# Altium project DRV8874 MOTOR DRV.PrjPcb
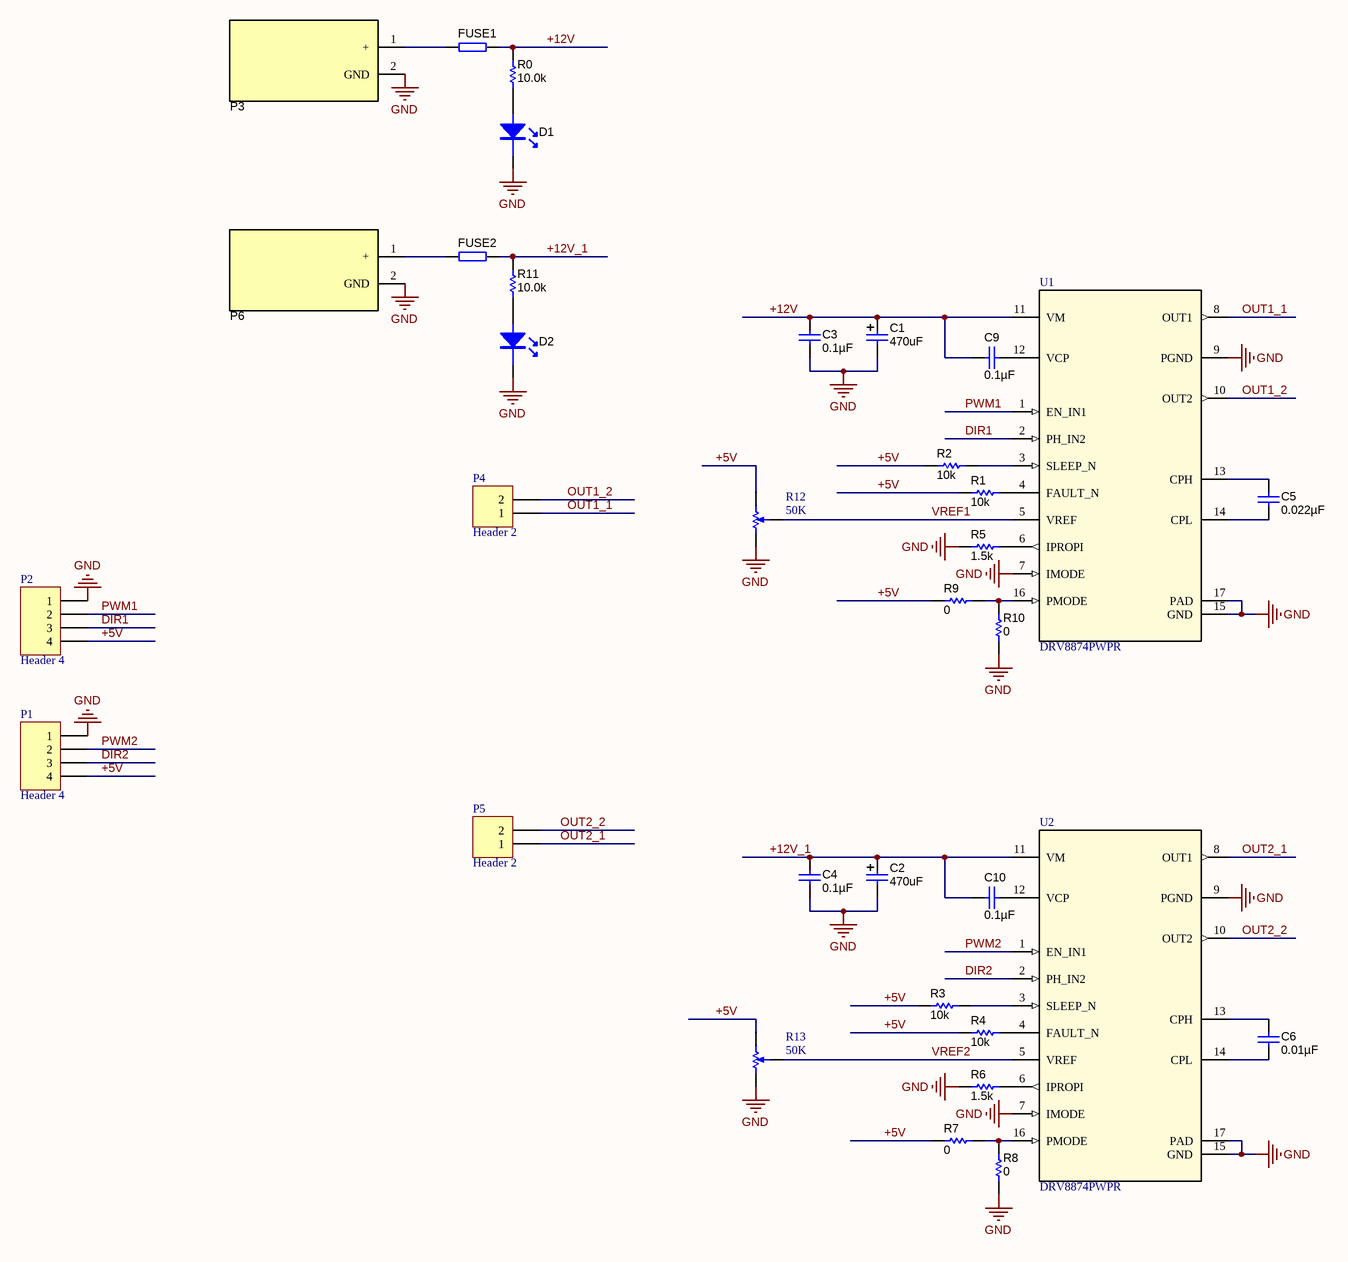
[diagram p0: DRV8874 MOTOR DRV.SchDoc]
1 sheet, 34 parts. Net scope: global (net labels, ports and power ports of the same name join across sheets).
Board file: DRV8874 MOTOR DRV.PcbDoc

## Sheet DRV8874 MOTOR DRV.SchDoc
size A2

### Parts
C1  470uF  [CAP]
C2  470uF  [CAP]
C3  ValueDisplayed: 0.1µF  [0805_HV]  (hidden comment: 08051C103JAT2A)
C4  ValueDisplayed: 0.1µF  [0805_HV]  (hidden comment: 08051C103JAT2A)
C5  ValueDisplayed: 0.022µF  [0805_HV]  (hidden comment: 08051C103JAT2A)
C6  ValueDisplayed: 0.01µF  [0805_HV]  (hidden comment: 08051C103JAT2A)
C9  ValueDisplayed: 0.1µF  [0805_HV]  (hidden comment: 08051C103JAT2A)
C10  ValueDisplayed: 0.1µF  [0805_HV]  (hidden comment: 08051C103JAT2A)
D1  RED  [0805_HV]  (value not drawn)
D2  RED  [0805_HV]  (value not drawn)
FUSE1  (no value)  [1206]
FUSE2  (no value)  [1206]
P1  Header 4  [HDR1X4]
P2  Header 4  [HDR1X4]
P3  Used in BOM report  [2p]  (value not drawn)
P4  Header 2  [2p]
P5  Header 2  [2p]
P6  Used in BOM report  [2p]  (value not drawn)
R0  ValueDisplayed: 10.0k  [0805_HV]  (hidden comment: CRCW080510K0FKEA)
R1  ValueDisplayed: 10k  [0805_HV]  (hidden comment: CRCW080510K0FKEA)
R2  ValueDisplayed: 10k  [0805_HV]  (hidden comment: CRCW080510K0FKEA)
R3  ValueDisplayed: 10k  [0805_HV]  (hidden comment: CRCW080510K0FKEA)
R4  ValueDisplayed: 10k  [0805_HV]  (hidden comment: CRCW080510K0FKEA)
R5  ValueDisplayed: 1.5k  [0805_HV]  (hidden comment: CRCW080510K0FKEA)
R6  ValueDisplayed: 1.5k  [0805_HV]  (hidden comment: CRCW080510K0FKEA)
R7  ValueDisplayed: 0  [0805_HV]  (hidden comment: CRCW080510K0FKEA)
R8  ValueDisplayed: 0  [0805_HV]  (hidden comment: CRCW080510K0FKEA)
R9  ValueDisplayed: 0  [0805_HV]  (hidden comment: CRCW080510K0FKEA)
R10  ValueDisplayed: 0  [0805_HV]  (hidden comment: CRCW080510K0FKEA)
R11  ValueDisplayed: 10.0k  [0805_HV]  (hidden comment: CRCW080510K0FKEA)
R12  50K  [POT4MM-2]
R13  50K  [POT4MM-2]
U1  DRV8874PWPR  [PWP0016J_M]
U2  DRV8874PWPR  [PWP0016J_M]

### Nets
GND: C1.1 C2.1 C3.2 C4.2 D1.2 D2.2 P1.1 P2.1 P3.2(GND) P6.2(GND) R5.2 R6.2 R8.2 R10.2 R12.CCW(-) R13.CCW(-) U1.7(IMODE) U1.9(PGND) U1.15(GND) U1.17(PAD) U2.7(IMODE) U2.9(PGND) U2.15(GND) U2.17(PAD)
+5V: P1.4 P2.4 R1.2 R2.2 R3.2 R4.2 R7.2 R9.1 R12.CW(+) R13.CW(+)
+12V: C1.2 C3.1 C9.1 FUSE1.2 R0.1 U1.11(VM)
+12V_1: C2.2 C4.1 C10.1 FUSE2.2 R11.1 U2.11(VM)
DIR1: P2.3 U1.2(PH_IN2)
DIR2: P1.3 U2.2(PH_IN2)
OUT1_1: P4.1 U1.8(OUT1)
OUT1_2: P4.2 U1.10(OUT2)
OUT2_1: P5.1 U2.8(OUT1)
OUT2_2: P5.2 U2.10(OUT2)
PWM1: P2.2 U1.1(EN_IN1)
PWM2: P1.2 U2.1(EN_IN1)
VREF1: R12.W U1.5(VREF)
VREF2: R13.W U2.5(VREF)
NetC5_1: C5.1 U1.14(CPL)
NetC5_2: C5.2 U1.13(CPH)
NetC6_1: C6.1 U2.14(CPL)
NetC6_2: C6.2 U2.13(CPH)
NetC9_2: C9.2 U1.12(VCP)
NetC10_2: C10.2 U2.12(VCP)
NetD1_1: D1.1 R0.2
NetD2_1: D2.1 R11.2
NetFUSE1_1: FUSE1.1 P3.1(+)
NetFUSE2_1: FUSE2.1 P6.1(+)
NetR1_1: R1.1 U1.4(FAULT_N)
NetR2_1: R2.1 U1.3(SLEEP_N)
NetR3_1: R3.1 U2.3(SLEEP_N)
NetR4_1: R4.1 U2.4(FAULT_N)
NetR5_1: R5.1 U1.6(IPROPI)
NetR6_1: R6.1 U2.6(IPROPI)
NetR7_1: R7.1 R8.1 U2.16(PMODE)
NetR9_2: R9.2 R10.1 U1.16(PMODE)

### Library data of the parts
C1 C2 = Cap_100uF: Manufacturer: Used in BOM report; CompType: Used in some BOM reports.  Useful for finding later.; MountType: SMT, TH, or N/A; RoHS: Used in BOM report.  Use Y or N.; PartNumber: Used in BOM report; PackageReference: eg:  0603, used in PnP report; ComponentLink1Description: Datasheet Link; Alternate PartNumber: -; Alternate Manufacturer: -
C3-C6 C9 C10 = 08051C103JAT2A: CAP, CERM, 0.01 µF, 100 V, +/- 5%, X7R, 0805; Manufacturer: AVX; Polarized: N; CompType: Capacitor; Value: 0.01uF; U/M: EA; Cap_F: 0.00000001; Tolerance_%: 5; ESR_ohm: 0.078; Value1: 0.078 ohm; VDC_V: 100; Value2: 100V; TaMin_C: -55; TaMax_C: 125; Cap_Case: 0805; SizeArea_mm2: 2.5; SizeAreaWB_mm2: 6.75; SizeX_mm: 2; SizeY_mm: 1.25; SizeZ_mm: 1.45; AEC Category: Q200; SymbolVersion: 2008-07-09; PartNumber: 08051C103JAT2A; PackageReference: 0805; RoHS: Y; MountType: SMT; Technology: Ceramic; TempCo: X7R; Published: 2008-06-19; Publisher: Texas Instruments; LatestRevisionDate: 2016-08-09; ComponentLink1Description: Datasheet link; ComponentLink1URL: http://datasheets.avx.com/X7RDielectric.pdf; Supplier 1: Digi-Key; Supplier Part Number 1: 478-3745-1-ND; Supplier 2: Mouser; Supplier Part Number 2: 581-08051C103J; Supplier 3: Farnell; Supplier Part Number 3: 1396066; AEC Qualified: N; AEC Grade: N/A
D1 D2 = LED: LED·¢¹â¹Ü
FUSE1 FUSE2 = R: µç×è
P1 P2 = Header 4: Header, 4-Pin; LatestRevisionDate: 17-Jul-2002; LatestRevisionNote: Re-released for DXP Platform.; Publisher: Altium Limited
P3 P6 = PWR5.5: CompType: Used in some BOM reports.  Useful for finding later.; Manufacturer: Used in BOM report; MountType: SMT, TH, or N/A; RoHS: Used in BOM report.  Use Y or N.; PartNumber: Used in BOM report; PackageReference: eg:  0603, used in PnP report; ComponentLink1Description: Datasheet Link; Alternate PartNumber: -; Alternate Manufacturer: -
P4 P5 = Header 2: Header, 2-Pin; LatestRevisionDate: 17-Jul-2002; LatestRevisionNote: Re-released for DXP Platform.; Publisher: Altium Limited
R0-R11 = CRCW080510K0FKEA: RES, 10.0 k, 1%, 0.125 W, 0805; Manufacturer: Vishay-Dale; CompType: Resistor; Value: 10.0k; Res_ohm: 10000; Value_Code: 10k0; Tolerance_%: 1; Power_W: 0.125; Value2: 0.125W; VDC_V: 150; TempCo: 100 ppm/C; SizeArea_mm2: 2.5; SizeX_mm: 2; SizeY_mm: 1.25; SizeZ_mm: 1.45; EIA_Code: E96; U/M: EA; AEC Category: Q200; SymbolVersion: 2009-05-29; PartNumber: CRCW080510K0FKEA; PackageReference: 0805; RoHS: Y; Value1: 1%; MountType: SMT; Technology: Thick Film; Published: 2008-06-26; Publisher: Texas Instruments; LatestRevisionDate: 2016-08-02; ComponentLink1Description: Datasheet link; ComponentLink1URL: http://www.vishay.com/docs/20035/dcrcwe3.pdf; Supplier 1: Digi-Key; Supplier Part Number 1: 541-10.0KCCT-ND; Supplier 2: Mouser; Supplier Part Number 2: 71-CRCW0805-10K-E3; Supplier 3: Farnell; Supplier Part Number 3: 1469856; AEC Qualified: ?
R12 R13 = RPot SM: Square Trimming Potentiometer; Published: 17-Dec-2003; DatasheetVersion: Oct-2003; PackageReference: POT4MM-2; Publisher: Altium Limited; PackageDescription: Square Trimming Potentiometer; ComponentLink1Description: Manufacturer Link; ComponentLink1URL: http://bourns.com/2/search.html
U1 U2 = DRV8874PWPR: Imported; Manufacturer: Texas Instruments; PartNumber: DRV8874PWPR; RefDes: RefDes; TYPE: TYPE; Value: Value